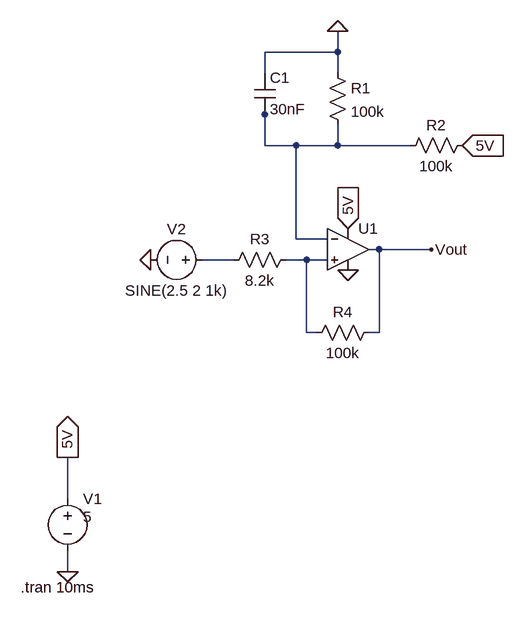
[diagram p0: schematic SchmittTrigger1.asc]
SchmittTrigger1.asc, the LTspice schematic file:
Version 4
SHEET 1 1156 680
WIRE 384 -368 384 -400
WIRE 384 -368 272 -368
WIRE 272 -336 272 -368
WIRE 384 -336 384 -368
WIRE 272 -272 272 -288
WIRE 272 -224 272 -272
WIRE 320 -224 272 -224
WIRE 384 -224 384 -256
WIRE 384 -224 320 -224
WIRE 496 -224 384 -224
WIRE 320 -80 320 -224
WIRE 368 -80 320 -80
WIRE 448 -64 432 -64
WIRE 528 -64 448 -64
WIRE 224 -48 176 -48
WIRE 336 -48 304 -48
WIRE 368 -48 336 -48
WIRE 336 64 336 -48
WIRE 352 64 336 64
WIRE 448 64 448 -64
WIRE 448 64 432 64
WIRE -32 320 -32 256
WIRE -32 432 -32 400
FLAG -32 432 0
FLAG 400 -96 5V
IOPIN 400 -96 In
FLAG -32 256 5V
IOPIN -32 256 Out
FLAG 400 -32 0
FLAG 576 -224 5V
IOPIN 576 -224 In
FLAG 384 -400 0
FLAG 528 -64 Vout
FLAG 96 -48 0
SYMBOL voltage -32 304 R0
WINDOW 3 24 44 Left 2
WINDOW 123 0 0 Left 0
WINDOW 39 0 0 Left 0
SYMATTR InstName V1
SYMATTR Value 5
SYMBOL res 368 -352 R0
SYMATTR InstName R1
SYMATTR Value 100k
SYMBOL res 592 -240 R90
WINDOW 0 0 56 VBottom 2
WINDOW 3 32 56 VTop 2
SYMATTR InstName R2
SYMATTR Value 100k
SYMBOL cap 256 -336 R0
SYMATTR InstName C1
SYMATTR Value 30nF
SYMBOL res 320 -64 R90
WINDOW 0 0 56 VBottom 2
WINDOW 3 32 56 VTop 2
SYMATTR InstName R3
SYMATTR Value 8.2k
SYMBOL res 448 48 R90
WINDOW 0 0 56 VBottom 2
WINDOW 3 32 56 VTop 2
SYMATTR InstName R4
SYMATTR Value 100k
SYMBOL voltage 192 -48 R90
WINDOW 0 -32 56 VBottom 2
WINDOW 3 32 56 VTop 2
WINDOW 123 0 0 Left 0
WINDOW 39 0 0 Left 0
SYMATTR InstName V2
SYMATTR Value SINE(2.5 2 1k)
SYMBOL OpAmps\\UniversalOpAmp2 400 -64 R0
SYMATTR InstName U1
TEXT -104 456 Left 2 !.tran 10ms

The netlist it stands for:
* SchmittTrigger1.asc
V1 5V 0 5
R1 0 N001 100k
R2 5V N001 100k
C1 0 N001 30nF
R3 N003 N002 8.2k
R4 Vout N003 100k
V2 N002 0 SINE(2.5 2 1k)
XU1 N003 N001 5V 0 Vout level2 Avol=1Meg GBW=10Meg Slew=10Meg Ilimit=25m Rail=0 Vos=0 En=0 Enk=0 In=0 Ink=0 Rin=500Meg  ; pins In+ In- V+ V- OUT
.tran 10ms
.lib UniversalOpAmp2.lib
.backanno
.end